# Altium schematic sheet Limiter.SchDoc
size A; SheetNumber: 3; SheetTotal: 7
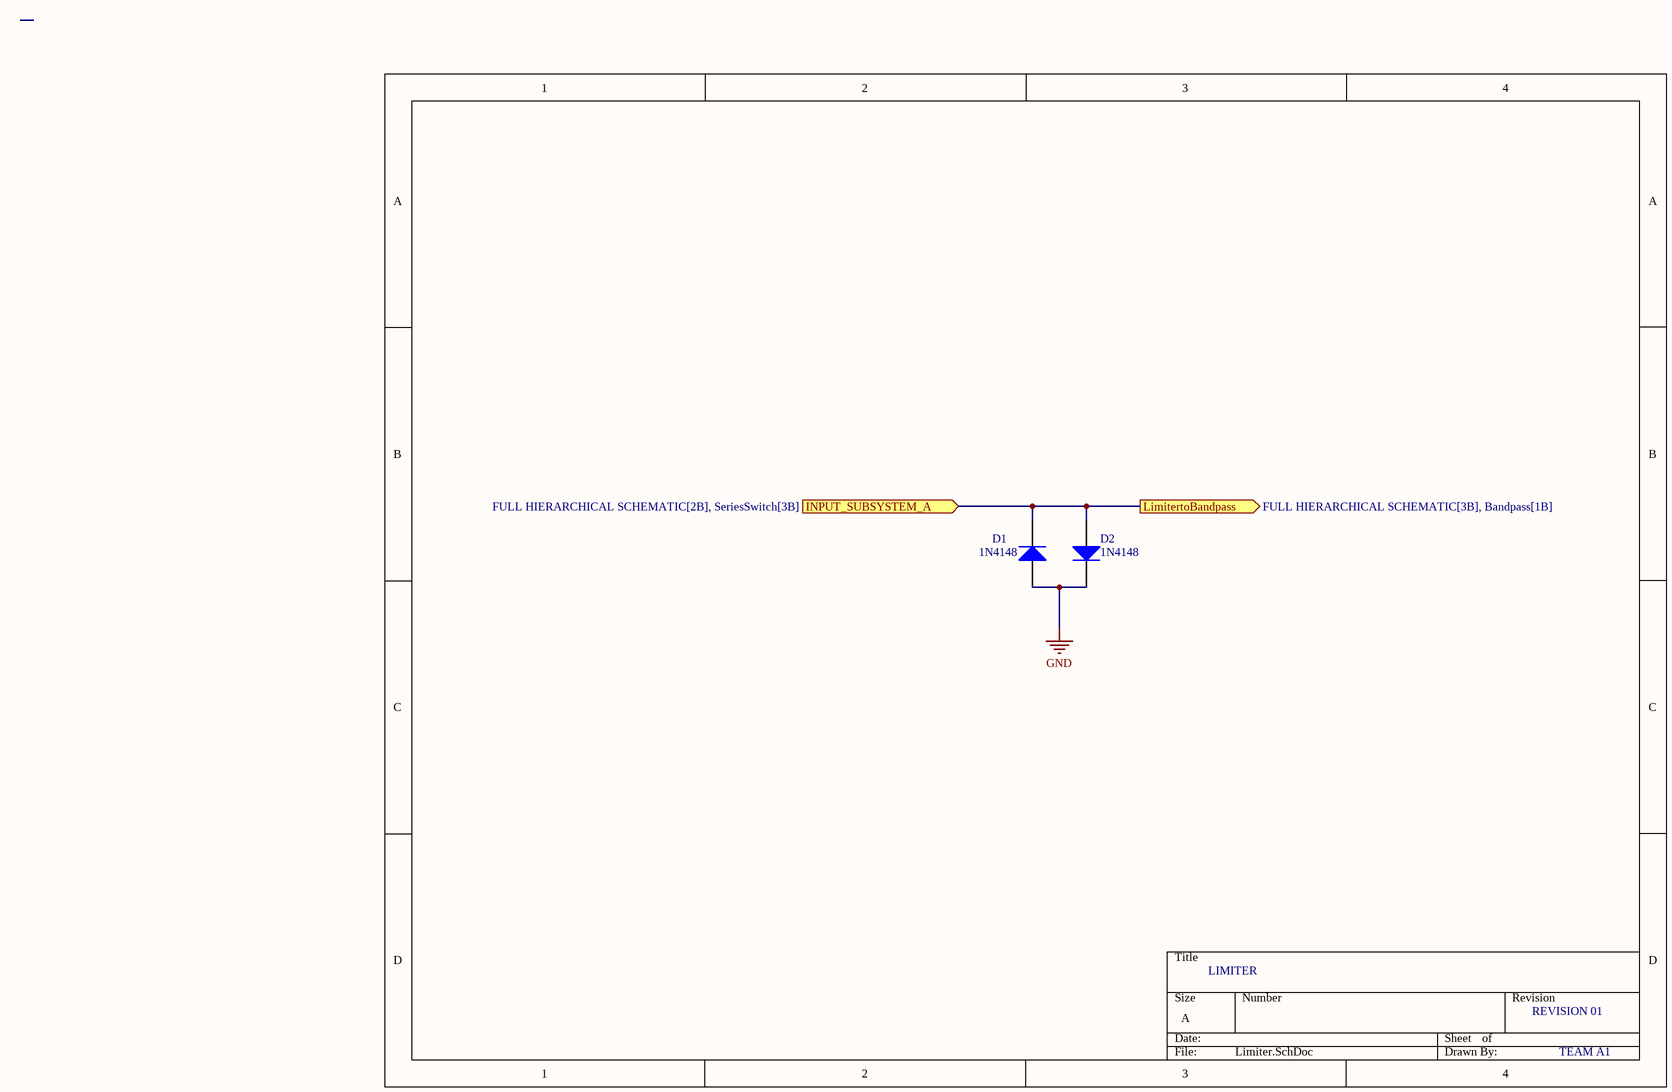
[diagram p0: Limiter.SchDoc]

## Parts
D1  1N4148  [NXP-SOD27-2_V]
D2  1N4148  [NXP-SOD27-2_V]

## Ports
INPUT_SUBSYSTEM_A (in, see FULL HIERARCHICAL SCHEMATIC[2B], SeriesSwitch[3B]), LimitertoBandpass (out, see FULL HIERARCHICAL SCHEMATIC[3B], Bandpass[1B])

## Nets
GND: D1.1(A) D2.2(K)
INPUT_SUBSYSTEM_A: D1.2(K) D2.1(A) ; port INPUT_SUBSYSTEM_A, port LimitertoBandpass

## Notes on the sheet
- LIMITER
- REVISION 01
- TEAM A1

## Library data of the parts
D1 D2 = CMP-0648-00002-1: High-speed Diode, 100 V, 450 mA, 2-Pin SOD27, RoHS; Manufacturer: NXP Semiconductors; Configuration: Single; IR (VR: 20 V)=25 nA; IFRM: 450 mA; IFSM: 4 A Max.; Trr: 4 ns Max.; Cd: 4 pF Max.; VR: 100 V Max.; VF (IF: 10 mA)=1 V; IF: 200 mA Max.; ComponentLink1Description: Manufacturer URL; RoHS: TRUE; ComponentLink1URL: http://www.nxp.com/; ComponentLink3Description: Package Specification; DatasheetVersion: Aug-04; ComponentLink2Description: Datasheet; PackageVersion: Aug-04; PackageReference: SOD27; ComponentLink3URL: http://www.nxp.com/documents/data_sheet/1N4148_1N4448.pdf; Mounting Technology: Through Hole; ComponentLink2URL: http://www.nxp.com/documents/data_sheet/1N4148_1N4448.pdf; PartNumber: 1N4148; PackageDescription: 2-Pin Hermetically Sealed Glass Package, Axial Leaded, Dia 1.85 mm, Body Length 4.25 mm, Lead Spread 25.4 mm